# EAGLE schematic Macropad Schematic (EAGLE 9.7.0)
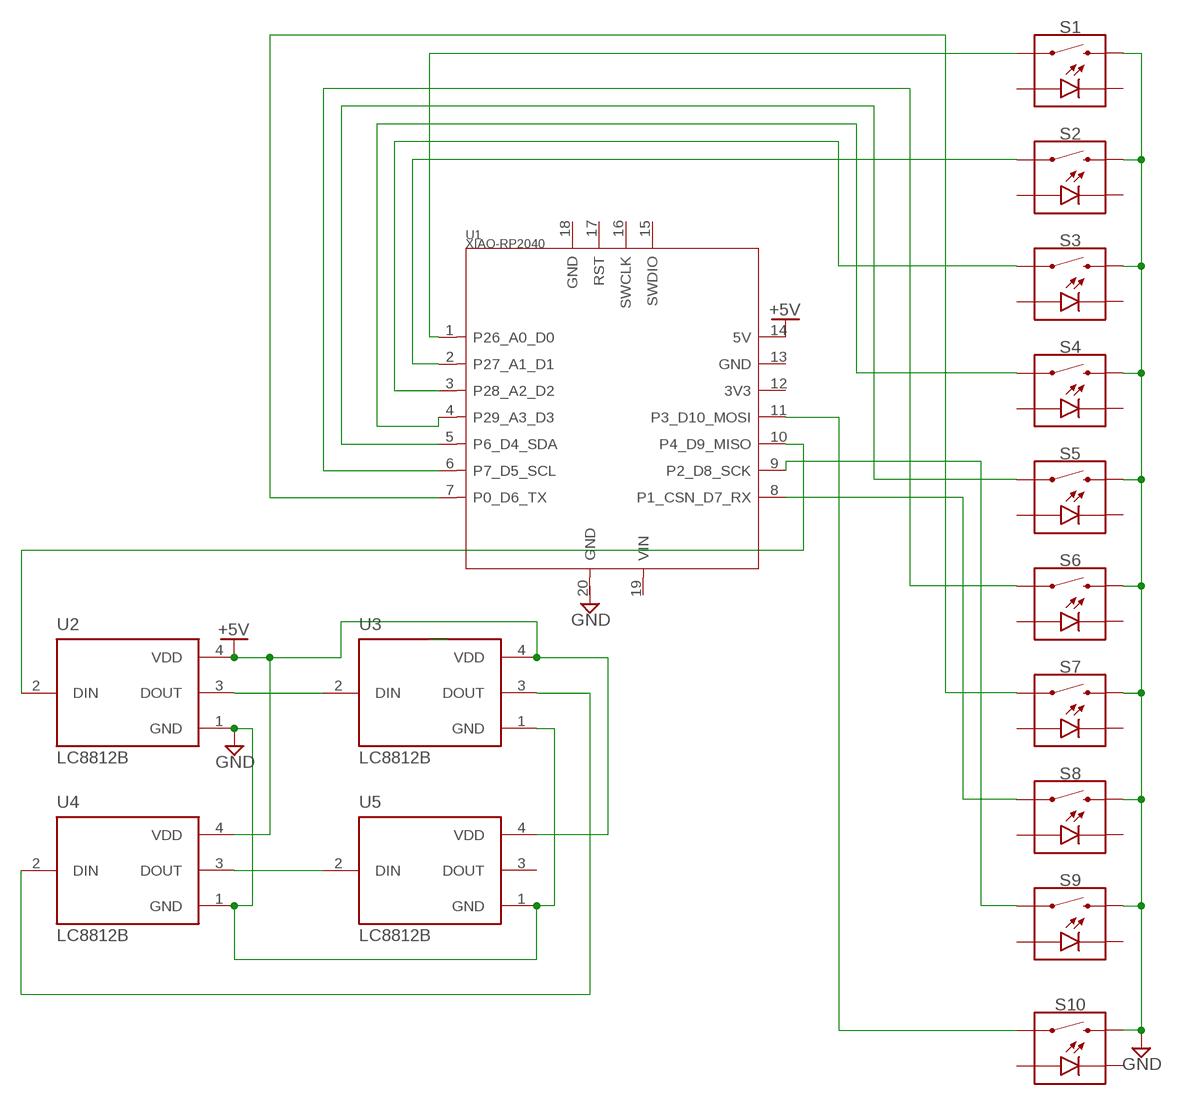
[diagram p0: schematic, sheet 1]

## Parts
S1  MECHANICAL-KEYBOARD1U  [CHERRY-MX-LED-1U]
S2  MECHANICAL-KEYBOARD1U  [CHERRY-MX-LED-1U]
S3  MECHANICAL-KEYBOARD1U  [CHERRY-MX-LED-1U]
S4  MECHANICAL-KEYBOARD1U  [CHERRY-MX-LED-1U]
S5  MECHANICAL-KEYBOARD1U  [CHERRY-MX-LED-1U]
S6  MECHANICAL-KEYBOARD1U  [CHERRY-MX-LED-1U]
S7  MECHANICAL-KEYBOARD1U  [CHERRY-MX-LED-1U]
S8  MECHANICAL-KEYBOARD1U  [CHERRY-MX-LED-1U]
S9  MECHANICAL-KEYBOARD1U  [CHERRY-MX-LED-1U]
S10  MECHANICAL-KEYBOARD1U  [CHERRY-MX-LED-1U]
U1  XIAO-RP2040  [XIAO-SAMD21/RP2040-MODULE14P-2.54-21X17.8MM]
U2  LC8812B  [SOL320P540X157-4N]
U3  LC8812B  [SOL320P540X157-4N]
U4  LC8812B  [SOL320P540X157-4N]
U5  LC8812B  [SOL320P540X157-4N]

## Nets
+5V: U1.14(5V) U2.4(VDD) U3.4(VDD) U4.4(VDD) U5.4(VDD)
GND: S1.S2 S2.S2 S3.S2 S4.S2 S5.S2 S6.S2 S7.S2 S8.S2 S9.S2 S10.S2 U2.1(GND) U3.1(GND) U4.1(GND) U5.1(GND)
N$1: U2.3(DOUT) U3.2(DIN)
N$2: U4.3(DOUT) U5.2(DIN)
N$3: U3.3(DOUT) U4.2(DIN)
N$5: U1.10(P4_D9_MISO) U2.2(DIN)
N$6: S10.S1 U1.11(P3_D10_MOSI)
N$9: S2.S1 U1.2(P27_A1_D1)
N$10: S3.S1 U1.3(P28_A2_D2)
N$11: S4.S1 U1.4(P29_A3_D3)
N$12: S5.S1 U1.5(P6_D4_SDA)
N$13: S6.S1 U1.6(P7_D5_SCL)
N$14: S7.S1 U1.7(P0_D6_TX)
N$15: S8.S1 U1.8(P1_CSN_D7_RX)
N$16: S9.S1 U1.9(P2_D8_SCK)
N$19: S1.S1 U1.1(P26_A0_D0)
Unconnected: S1.A S1.K(C) S2.A S2.K(C) S3.A S3.K(C) S4.A S4.K(C) S5.A S5.K(C) S6.A S6.K(C) S7.A S7.K(C) S8.A S8.K(C) S9.A S9.K(C) S10.A S10.K(C) U1.12(3V3) U1.13(GND) U1.15(SWDIO) U1.16(SWCLK) U1.17(RST) U1.18(GND) U1.19(VIN) U1.20(GND) U5.3(DOUT)

## Library data of the parts
S1-S10 = SparkFun-Switches:MECHANICAL-KEYBOARD: Mechanical Keyboard Spacings for Cherry-MX Cherry-MX w/ LED switch footprints. Each package variant contains a bounding box on the tDocu layer for proper key spacing and a dimensional drawing on the Reference layer to be exported for laser cut mounting plates. Footprints are off-center so that the origin lies on the lower left corner of the key-spacing. This allows for most common layouts to be easily acheived on a grid spacing of 0.1875" Variants 1U through 1.75U in .25U steps Centered switch cutout in SwitchPlate layer with no stabilizers 2U through 2.75U in .25U steps Centered switch cutout in SwitchPlate layer with Cherry+Costar stabilizer holes 6.25U Common spacebar size Centered switch cutout in SwitchPlate layer with Cherry+Costar stabilizer holes "Big Ass" Enter ANSI 104 "Big Ass" Enter Key layout ISO Enter ISO style Enter Key layout
U1 = Seeed Studio XIAO Series:XIAO-RP2040: Seeed Studio XIAO RP2040 v1.22 - Raspberry Pi RP2040 Microcontroller - 32-bit 133MHz Dual-Core ARM® Cortex® M0+processor Seeed SKU: 102010428 Seeed Studio XIAO RP2040 is a microcontroller using the Raspberry Pi RP2040 chip. The MCU runs at up to 133MHz. It is built with rich interfaces in a tiny thumb size and fully supports Arduino, MicroPython, and CircuitPython. The onboard interfaces are enough for developing multiple applications. Buy now <https://www.seeedstudio.com/XIAO-RP2040-v1-0-p-5026.html> Wiki <https://wiki.seeedstudio.com/XIAO-RP2040/>
U2-U5 = LC8812B:LC8812B: Check availability <https://pricing.snapeda.com/parts/LC8812B/Shenzhen%20LED%20Color%20Optoelectronic%20Inc./view-part?ref=eda>; AVAILABILITY: Not in stock; CHECK_PRICES: https://www.snapeda.com/parts/LC8812B/Shenzhen+LED+Color+Optoelectronic+Inc./view-part/?ref=eda; DESCRIPTION: 5050 SMD 0.2W intelligent external control LED; MF: Shenzhen LED Color Optoelectronic Inc.; MP: LC8812B; PACKAGE: Package; PRICE: None; SNAPEDA_LINK: https://www.snapeda.com/parts/LC8812B/Shenzhen+LED+Color+Optoelectronic+Inc./view-part/?ref=snap